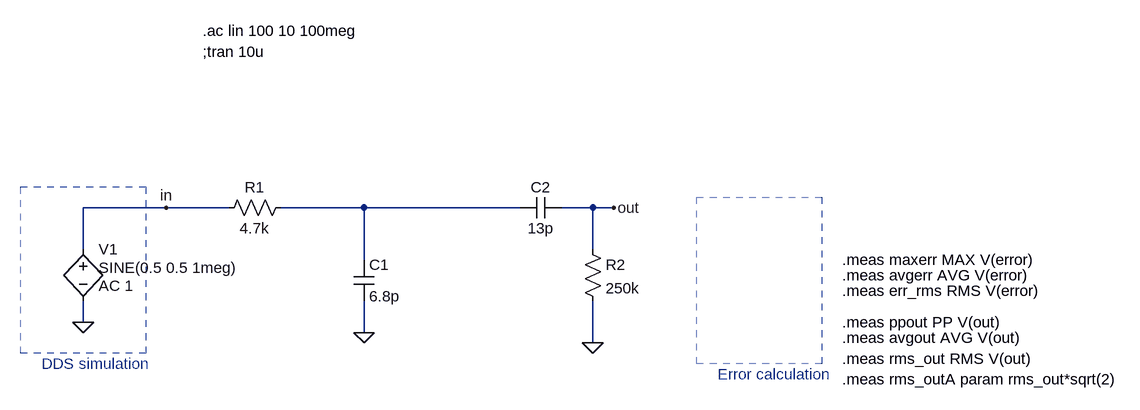
[diagram p0: schematic bandpassRC.asc]
bandpassRC.asc, the LTspice schematic file:
Version 4
SHEET 1 1680 680
WIRE 192 -16 64 -16
WIRE 288 -16 192 -16
WIRE 496 -16 368 -16
WIRE 736 -16 496 -16
WIRE 848 -16 800 -16
WIRE 880 -16 848 -16
WIRE 64 48 64 -16
WIRE 848 48 848 -16
WIRE 496 64 496 -16
WIRE 64 160 64 128
WIRE 496 176 496 128
WIRE 848 192 848 128
FLAG 64 160 0
FLAG 192 -16 in
FLAG 848 192 0
FLAG 496 176 0
FLAG 880 -16 out
SYMBOL bv 64 32 R0
WINDOW 3 24 44 Left 2
WINDOW 123 24 72 Left 2
WINDOW 39 0 0 Left 0
SYMATTR Value SINE(0.5 0.5 1meg)
SYMATTR InstName V1
SYMATTR Prefix V
SYMATTR Value2 AC 1
SYMBOL res 384 -32 R90
WINDOW 0 0 56 VBottom 2
WINDOW 3 32 56 VTop 2
SYMATTR InstName R1
SYMATTR Value 4.7k
SYMBOL cap 480 64 R0
SYMATTR InstName C1
SYMATTR Value 6.8p
SYMBOL cap 800 -32 R90
WINDOW 0 0 32 VBottom 2
WINDOW 3 32 32 VTop 2
SYMATTR InstName C2
SYMATTR Value 13p
SYMBOL res 832 32 R0
SYMATTR InstName R2
SYMATTR Value 250k
TEXT 248 -256 Left 2 !;tran 10u
TEXT 0 224 Left 2 ;DDS simulation
TEXT 1040 240 Left 2 ;Error calculation
TEXT 1232 64 Left 2 !.meas maxerr MAX V(error)
TEXT 1232 88 Left 2 !.meas avgerr AVG V(error)
TEXT 1232 112 Left 2 !.meas err_rms RMS V(error)
TEXT 1232 160 Left 2 !.meas ppout PP V(out)
TEXT 1232 184 Left 2 !.meas avgout AVG V(out)
TEXT 1232 216 Left 2 !.meas rms_out RMS V(out)
TEXT 1232 248 Left 2 !.meas rms_outA param rms_out*sqrt(2)
TEXT 248 -288 Left 2 !.ac lin 100 10 100meg
RECTANGLE Normal 160 208 -32 -48 2
RECTANGLE Normal 1200 224 1008 -32 2

The netlist it stands for:
* bandpassRC.asc
V1 in 0 SINE(0.5 0.5 1meg) AC 1
R1 N001 in 4.7k
C1 N001 0 6.8p
C2 out N001 13p
R2 out 0 250k
;tran 10u
* DDS simulation
* Error calculation
.meas maxerr MAX V(error)
.meas avgerr AVG V(error)
.meas err_rms RMS V(error)
.meas ppout PP V(out)
.meas avgout AVG V(out)
.meas rms_out RMS V(out)
.meas rms_outA param rms_out*sqrt(2)
.ac lin 100 10 100meg
.backanno
.end